# Altium schematic sheet TrafficLightHeaderBoard.SchDoc
size A4
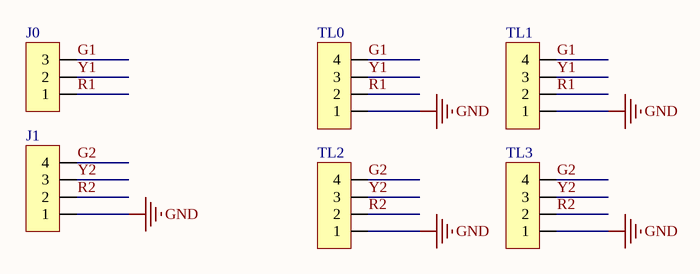
[diagram p0: TrafficLightHeaderBoard.SchDoc]

## Parts
J0  Header 3  [Header 3]  (value not drawn)
J1  Header 4  [Header 4]  (value not drawn)
TL0  Header 4  [Header 4]  (value not drawn)
TL1  Header 4  [Header 4]  (value not drawn)
TL2  Header 4  [Header 4]  (value not drawn)
TL3  Header 4  [Header 4]  (value not drawn)

## Nets
GND: J1.1 TL0.1 TL1.1 TL2.1 TL3.1
G1: J0.3 TL0.4 TL1.4
G2: J1.4 TL2.4 TL3.4
R1: J0.1 TL0.2 TL1.2
R2: J1.2 TL2.2 TL3.2
Y1: J0.2 TL0.3 TL1.3
Y2: J1.3 TL2.3 TL3.3

## Library data of the parts
J0 = Header 3: Header, 3-Pin
J1 TL0-TL3 = Header 4: Header, 4-Pin